# Altium project Bluetooh_Project.PrjPcb
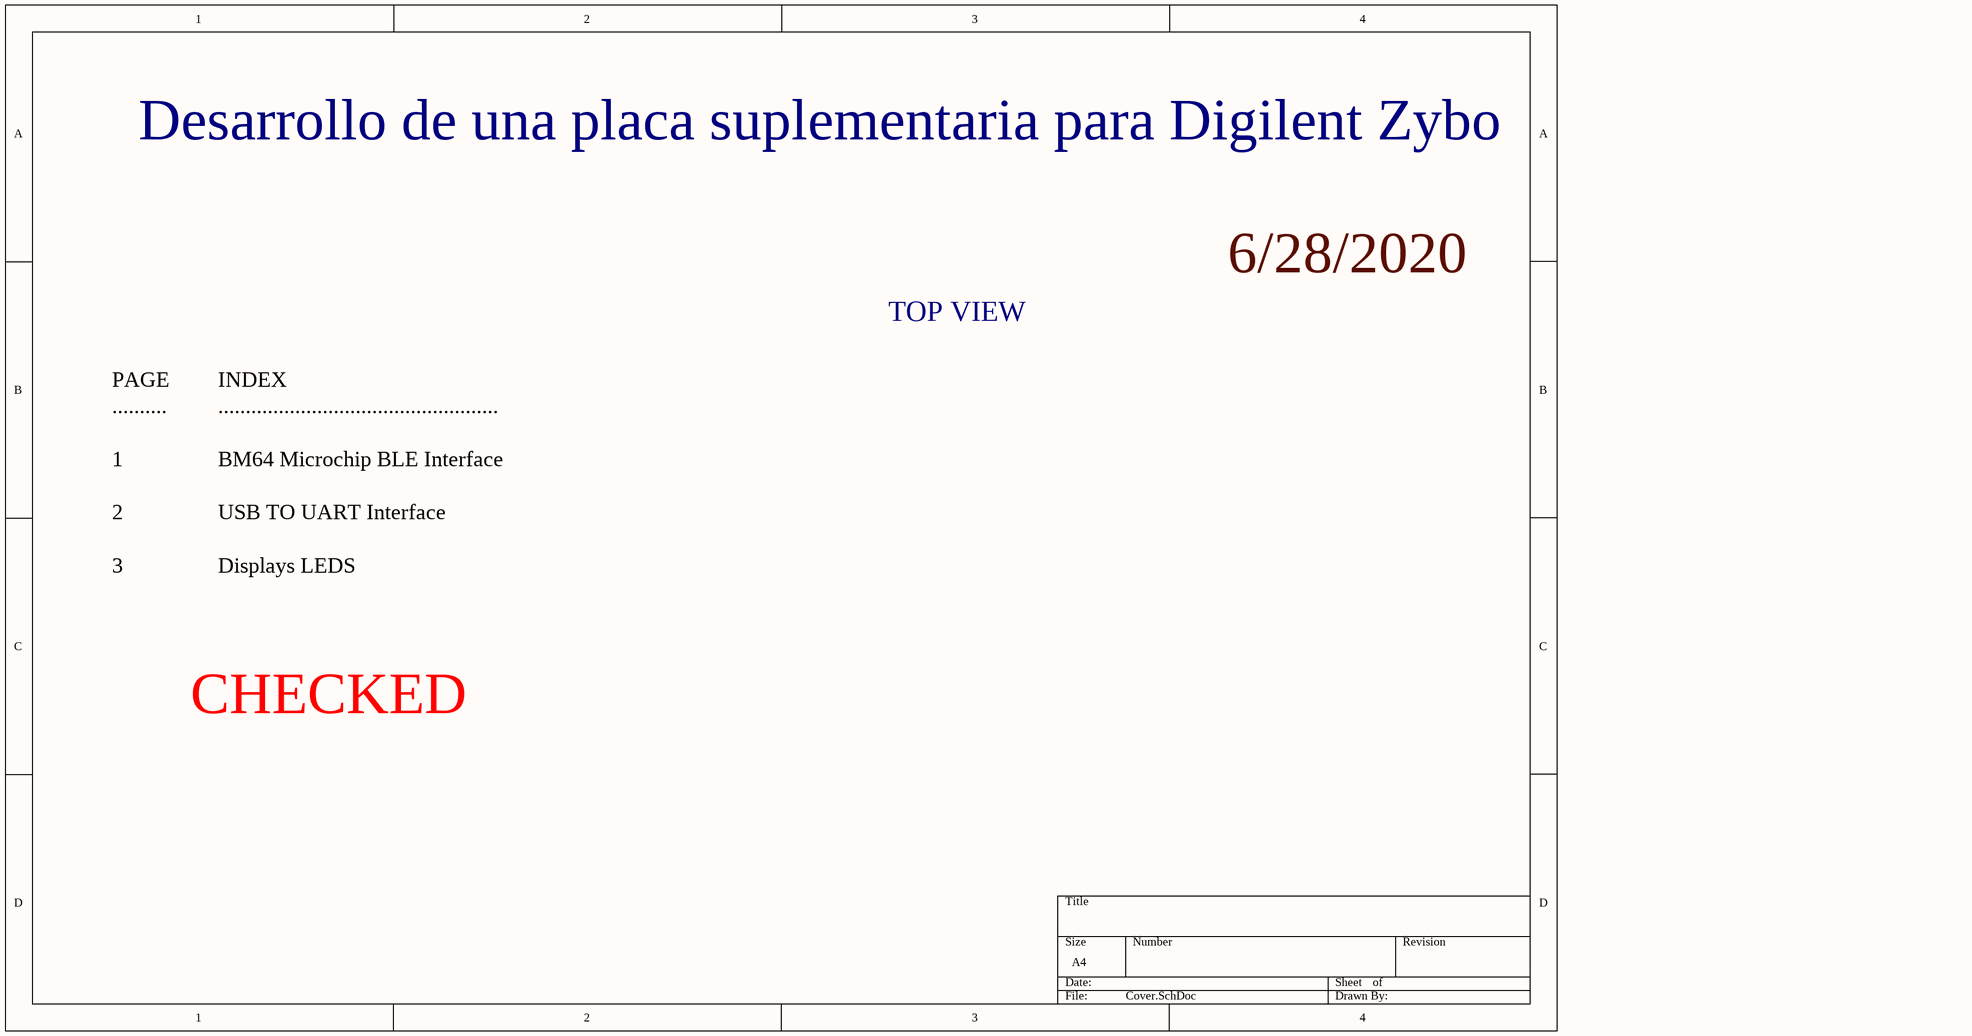
[diagram p0: Cover.SchDoc]
4 sheets, 59 parts. Net scope: global (net labels, ports and power ports of the same name join across sheets).
Board file: PCB1.PcbDoc
Sheets:
  Cover.SchDoc
  1_BLE.SchDoc
  2_USB_UART.SchDoc
  3_DISPLAY.SchDoc

## Sheet Cover.SchDoc
size A4; SheetNumber: 1; SheetTotal: 4

### Notes on the sheet
- Desarrollo de una placa suplementaria para Digilent Zybo
- 6/28/2020
- TOP VIEW
- PAGE
- ..........
- INDEX
- ...................................................
- 1
- BM64 Microchip BLE Interface
- 2
- 3
- USB TO UART Interface
- Displays LEDS
- CHECKED

## Sheet 1_BLE.SchDoc
size A4; SheetNumber: 2; SheetTotal: 4
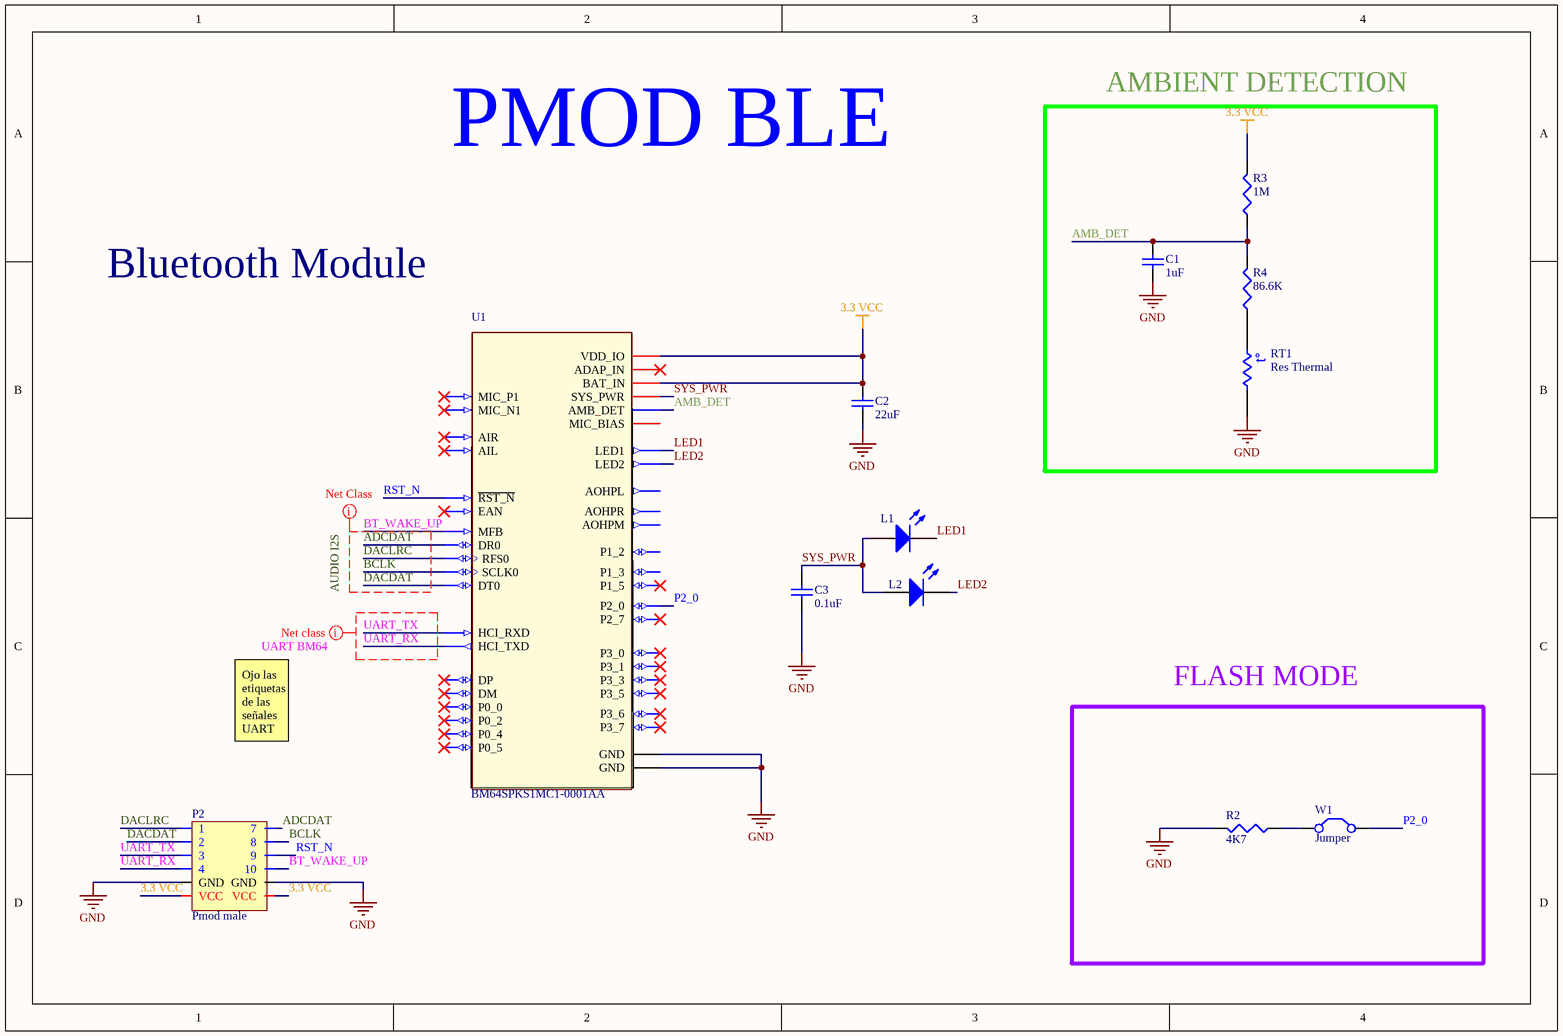
[diagram p1: 1_BLE.SchDoc]

### Parts
C1  1uF  [Cap0805]
C2  value 22uF  [C1210]  (hidden comment: Cap Semi)
C3  0.1uF  [Cap0805]
L1  LED1  [Diode1206]  (value not drawn)
L2  LED1  [Diode1206]  (value not drawn)
P2  Pmod male  [901220766]
R2  value 4K7  [Resistor 0805]  (hidden comment: Res3)
R3  value 1M  [Resistor 0805]  (hidden comment: Res3)
R4  value 86.6K  [Resistor 0805]  (hidden comment: Res3)
RT1  Res Thermal  [6-0805_N]
U1  BM64SPKS1MC1-0001AA  [*MODULE_BM64SPKS1MC1-0001AA]
W1  Jumper  [Shunt jumper]

### Blocks framed on the sheet
AMBIENT DETECTION: C1 R3 R4 RT1
FLASH MODE: R2 W1

### Nets
3.3 VCC: C2.2 P2.6(VCC) P2.12(VCC) R3.2 U1.21(VDD_IO) U1.22(BAT_IN)
GND: C1.1 C2.1 C3.2 P2.5(GND) P2.11(GND) R2.2 RT1.2 U1.14(GND) U1.43(GND)
ADCDAT: P2.7 U1.1(DR0)
AMB_DET: C1.2 R3.1 R4.2 U1.25(AMB_DET)
BCLK: P2.8 U1.3(SCLK0)
BT_WAKE_UP: P2.10 U1.26(MFB)
DACDAT: P2.2 U1.4(DT0)
DACLRC: P2.1 U1.2(RFS0)
LED1: L1.2(K) U1.28(LED1)
LED2: L2.2(K) U1.27(LED2)
P2_0: U1.41(P2_0) W1.2(C2)
RST_N: P2.9 U1.13(~{RST_N})
SYS_PWR: C3.1 L1.1(A) L2.1(A) U1.24(SYS_PWR)
UART_RX: P2.4 U1.20(HCI_TXD)
UART_TX: P2.3 U1.19(HCI_RXD)
NetR2_1: R2.1 W1.1(C1)
NetR4_1: R4.1 RT1.1

Not connected (* = marked no-connect by the designer): U1 5(AOHPR) 6(AOHPM) 7(AOHPL) 8(MIC_N1)* 9(MIC_P1)* 10(MIC_BIAS) 11(AIR)* 12(AIL)* 15(P1_2) 16(P1_3) 17(P0_4)* 18(P1_5)* 23(ADAP_IN)* 29(P3_7)* 30(P3_5)* 31(P0_0)* 32(EAN)* 33(DM)* 34(DP)* 35(P0_5)* 36(P3_0)* 37(P3_1)* 38(P3_3)* 39(P3_6)* 40(P0_2)* 42(P2_7)*

### Layout directives
net class AUDIO I2S: ADCDAT, BCLK, BT_WAKE_UP, DACDAT, DACLRC
net class UART BM64: UART_RX, UART_TX

### Notes on the sheet
- PMOD BLE
- Bluetooth Module
- Ojo las etiquetas de las señales UART son de las del dispositivo que se conecte
- (in symbol Res Thermal) t°

### Library data of the parts
C1 C3 = Cap: capacitor; ASiD Part Number: C-AS; Volte: 25v; ClassName: OutBuck
  C1: Value: 1uF
  C3: Value: 0.1uF
C2 = Cap Semi: Capacitor (Semiconductor SIM Model); Published: 8-Jun-2000; LatestRevisionDate: 29-May-2009; LatestRevisionNote: IPC-7351 Footprint Added.; PackageReference: C1206; Publisher: Altium Limited; PackageDescription: Chip Capacitor
L1 L2 = LED1: Typical RED GaAs LED; Published: 8-Jun-2000; LatestRevisionDate: 08-Jul-2005; LatestRevisionNote: Mech Layer 1 removed.; PackageReference: LED-1; Publisher: Altium Limited; PackageDescription: LED; 2 Leads; Digi-KeyReference: 732-13395-1-ND
P2 = Pmod male: p mod male 6 position 2 rows
R2-R4 = Res3: Resistor; Published: 8-Jun-2000; LatestRevisionDate: 29-May-2009; LatestRevisionNote: IPC-7351 Footprint Added.; PackageReference: J1-0603; Publisher: Altium Limited; PackageDescription: Chip Resistor
RT1 = Res Thermal: Thermistor; R at 25: 100k; Published: 24-Mar-1999; LatestRevisionDate: 29-May-2009; LatestRevisionNote: IPC-7351 Footprint Added.; PackageVersion: Mar-2003; PackageReference: 6-0805; Publisher: Altium Limited; PackageDescription: Chip Resistor 0805 Case Size; Code_IPC: RESC2012; Digi-KeyReference: BC2562CT-ND
U1 = BM64SPKS1MC1-0001AA: Bluetooth Bluetooth v5.0 Transceiver Module 2.4GHz Integrated, Trace Surface Mount; MF: Microchip; Availability: Unavailable; Package: Module Microchip; Price: None; MP: BM64SPKS1MC1-0001AA; SnapEDA_Link: https://www.snapeda.com/parts/BM64SPKS1MC1-0001AA/Microchip/view-part/613145/?ref=snap; Value: *
W1 = Jumper: Jumper Wire; Published: 24-Mar-1999; LatestRevisionDate: 17-Jul-2002; LatestRevisionNote: Re-released for DXP Platform.; PackageReference: RAD-0.2; Publisher: Altium Limited; PackageDescription: Radial Cap, Thru-Hole; 2 Leads; 0.2 in Pin Spacing; Digi-KeyReferencer: S9000-ND

## Sheet 2_USB_UART.SchDoc
size A4; SheetNumber: 3; SheetTotal: 4
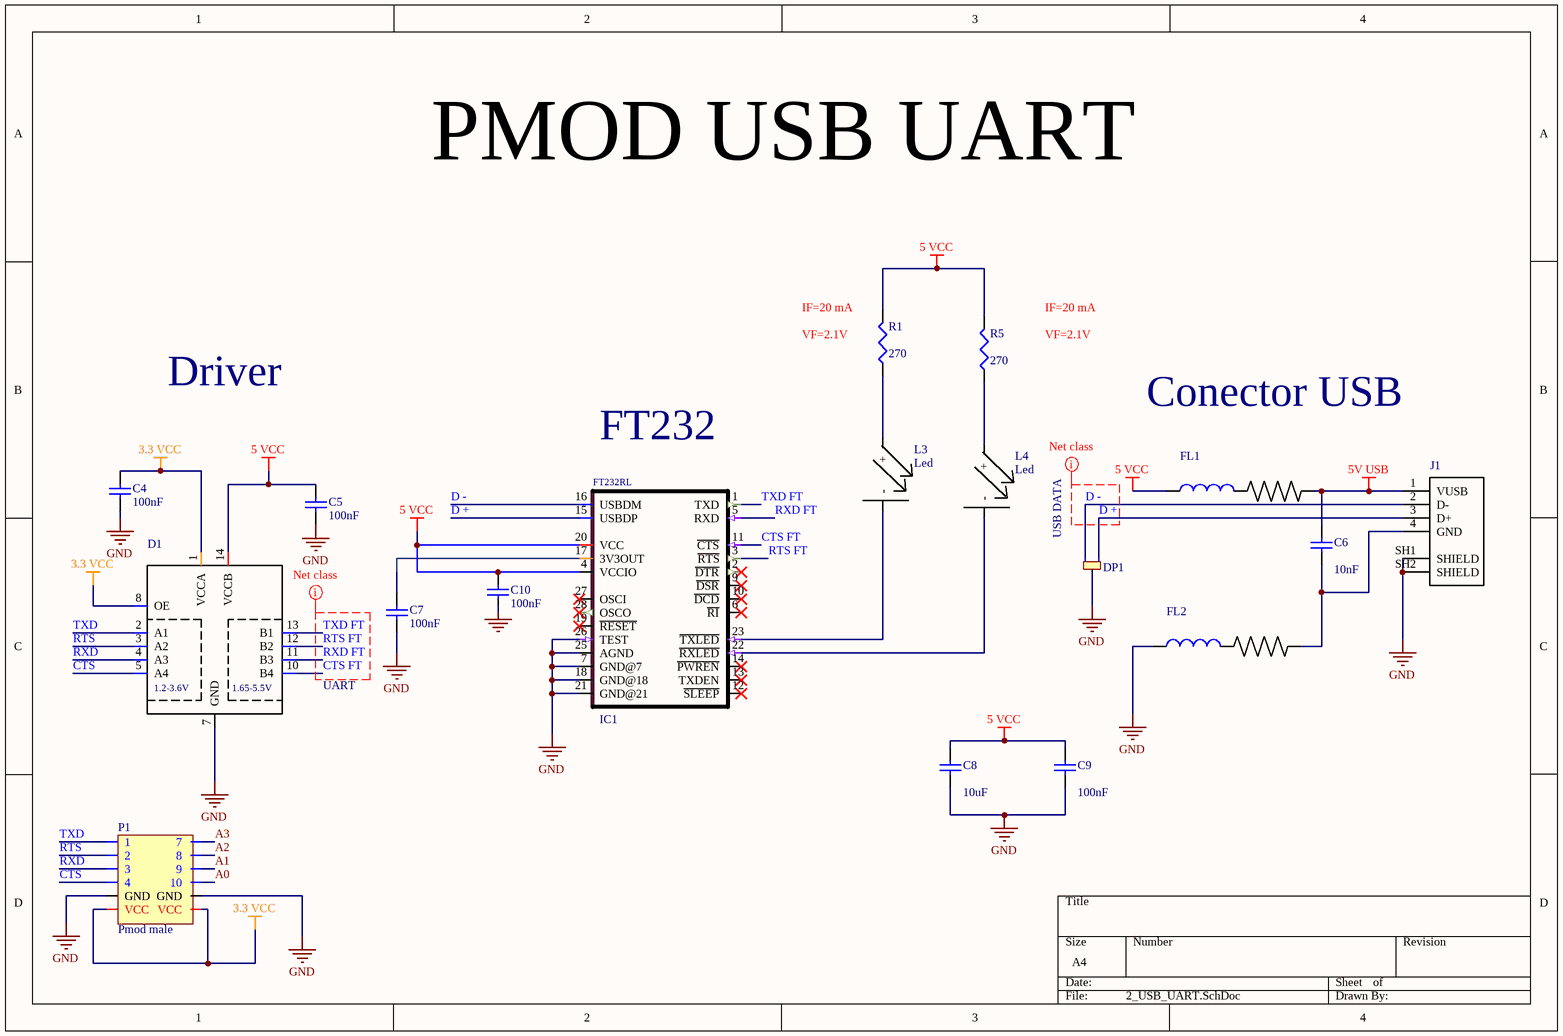
[diagram p2: 2_USB_UART.SchDoc]

### Parts
C4  value 100nF  [1608[0603]]  (hidden comment: Cap Semi)
C5  value 100nF  [1608[0603]]  (hidden comment: Cap Semi)
C6  value 10nF  [1608[0603]]  (hidden comment: Cap Semi)
C7  value 100nF  [1608[0603]]  (hidden comment: Cap Semi)
C8  value 10uF  [1608[0603]]  (hidden comment: Cap Semi)
C9  value 100nF  [1608[0603]]  (hidden comment: Cap Semi)
C10  value 100nF  [1608[0603]]  (hidden comment: Cap Semi)
D1  TXB0104PWR  [*TSSOP14]  (value not drawn)
DP1  PESD5V0U2BT,215  [*SOT95P230X110-3N]  (value not drawn)
FL1  BLM21PG221SN1D  [*BEADC2012X105N]  (value not drawn)
FL2  BLM21PG221SN1D  [*BEADC2012X105N]  (value not drawn)
IC1  FT232RL  [*SSOP28-LD]  (value not drawn)
J1  1-1734346-1  [*TE_1-1734346-1_1-1734346-1(Primary)]  (value not drawn)
L3  Led  [Diode1206 - PIN LETTER]
L4  Led  [Diode1206 - PIN LETTER]
P1  Pmod male  [901220766]
R1  value 270  [J1-0603]  (hidden comment: 270R)
R5  value 270  [J1-0603]  (hidden comment: 270R)

### Nets
3.3 VCC: C4.1 D1.1(VCCA) D1.8(OE) P1.6(VCC) P1.12(VCC)
5 VCC: C5.1 C8.2 C9.2 C10.1 D1.14(VCCB) FL1.1 IC1.4(VCCIO) IC1.20(VCC) R1.2 R5.2
5V USB: C6.2 FL1.2 J1.1(VUSB)
GND: C4.2 C5.2 C7.2 C8.1 C9.1 C10.2 D1.7(GND) DP1.3 FL2.1 IC1.7(GND@7) IC1.18(GND@18) IC1.21(GND@21) IC1.25(AGND) IC1.26(TEST) J1.SH1(SHIELD) J1.SH2(SHIELD) P1.5(GND) P1.11(GND)
A0: P1.10
A1: P1.9
A2: P1.8
A3: P1.7
CTS: D1.5(A4) P1.4
CTS FT: D1.10(B4) IC1.11(~{CTS})
D +: DP1.1 IC1.15(USBDP) J1.3(D+)
D -: DP1.2 IC1.16(USBDM) J1.2(D-)
RTS: D1.3(A2) P1.2
RTS FT: D1.12(B2) IC1.3(~{RTS})
RXD: D1.4(A3) P1.3
RXD FT: D1.11(B3) IC1.5(RXD)
TXD: D1.2(A1) P1.1
TXD FT: D1.13(B1) IC1.1(TXD)
NetC6_1: C6.1 FL2.2 J1.4(GND)
NetC7_1: C7.1 IC1.17(3V3OUT)
NetIC1_22: IC1.22(~{RXLED}) L4.K(-)
NetIC1_23: IC1.23(~{TXLED}) L3.K(-)
NetL3_A: L3.A(+) R1.1
NetL4_A: L4.A(+) R5.1

Not connected (* = marked no-connect by the designer): IC1 2(~{DTR})* 6(~{RI})* 9(~{DSR})* 10(~{DCD})* 12(~{SLEEP})* 13(TXDEN)* 14(~{PWREN})* 19(~{RESET})* 27(OSCI)* 28(OSCO)*

### Layout directives
net class USB DATA: D +, D -
net class UART: CTS FT, RTS FT, RXD FT, TXD FT

### Notes on the sheet
- PMOD USB UART
- (near R1) IF=20 mA
- IF=20 mA
- (near R1) VF=2.1V
- VF=2.1V
- Driver
- FT232
- Conector USB
- (in symbol TXB0104PWR) 1.2-3.6V; 1.65-5.5V

### Library data of the parts
C4-C10 = Cap Semi: Capacitor (Semiconductor SIM Model); Published: 8-Jun-2000; LatestRevisionDate: 29-May-2009; LatestRevisionNote: IPC-7351 Footprint Added.; PackageReference: C1206; Publisher: Altium Limited; PackageDescription: Chip Capacitor
D1 = TXB0104PWR: 4-Bit Bidirectional Voltage-Level Shifter with Auto Direction Sensing and +/-15 kV ESD Protect 14-TSSOP -40 to 85; MF: Texas Instruments; SnapEDA_Link: https://www.snapeda.com/parts/TXB0104PWR/Texas%20Instruments/view-part/?ref=snap; MP: TXB0104PWR; Availability: Unavailable; Price: None; Package: TSSOP-14 Texas Instruments; Value: *; Digi-KeyReference: 296-21929-1-ND
DP1 = PESD5V0U2BT,215: TVS DIODE 5V SOT23; Manufacturer 1: Nexperia; Supplier 1: Digi-Key; Manufacturer Part Number 1: PESD5V0U2BT,215; Stock 1: 61061; Pricing 1: 1=0,44000, 10=0,35300, 100=0,24020, 500=0,18012, 1000=0,13510 (USD); RoHS: No; ComponentLink1URL: https://assets.nexperia.com/documents/data-sheet/PESD5V0U2BT.pdf?src-supplier=Digi-Key; ComponentLink1Description: https://assets.nexperia.com/documents/data-sheet/PESD5V0U2BT.pdf?src-supplier=Digi-Key; Supplier Part Number 1: 1727-3936-1-ND; Digi-KeyReference: 1727-3936-1-ND
FL1 FL2 = BLM21PG221SN1D: 220 Ohms @ 100MHz 1 Power Line Ferrite Bead 0805 (2012 Metric) 2A 45mOhm; MF: Murata; Package: 2012 Murata; Digi-Key_Part_Number: 490-1054-1-ND; SnapEDA_Link: https://www.snapeda.com/parts/BLM21PG221SN1D/Murata/view-part/12270/?ref=snap; MP: BLM21PG221SN1D; Value: *
IC1 = FT232RL: USB-to-UART 1-CH 256Byte FIFO 5V 28-Pin SSOP; MF: FTDI, Future; Availability: Unavailable; Package: SSOP-28 FTDI, Future; SnapEDA_Link: https://www.snapeda.com/parts/FT232RL/FTDI%2C%20Future%20Technology%20Devices%20International%20Ltd/view-part/?ref=snap; Price: None; MP: FT232RL; Value: *; Digi-KeyReference: 768-1007-1-ND
J1 = 1-1734346-1: Conn USB 2.0 Type B RCP 4 POS 1.25mm Solder RA SMD 4 Terminal 1 Port T/R; MF: TE Connectivity; MP: 1-1734346-1; SnapEDA_Link: https://www.snapeda.com/parts/1-1734346-1/TE%20Connectivity%20AMP%20Connectors/view-part/512451/?ref=snap; EU_RoHS_Compliance: Compliant; Digi-Key_Part_Number: A110862CT-ND; DigiKey-Purchase-URL: https://snapeda.com/shop?store=DigiKey&id=512451; Package: None; Value: *
P1 = Pmod male: p mod male 6 position 2 rows
R1 R5 = Res3: Resistor; Published: 8-Jun-2000; LatestRevisionDate: 29-May-2009; LatestRevisionNote: IPC-7351 Footprint Added.; PackageReference: J1-0603; Publisher: Altium Limited; PackageDescription: Chip Resistor
L3 L4 = Led: Digi-KeyReference: 732-13395-1-ND

## Sheet 3_DISPLAY.SchDoc
size A4; SheetNumber: 4; SheetTotal: 4
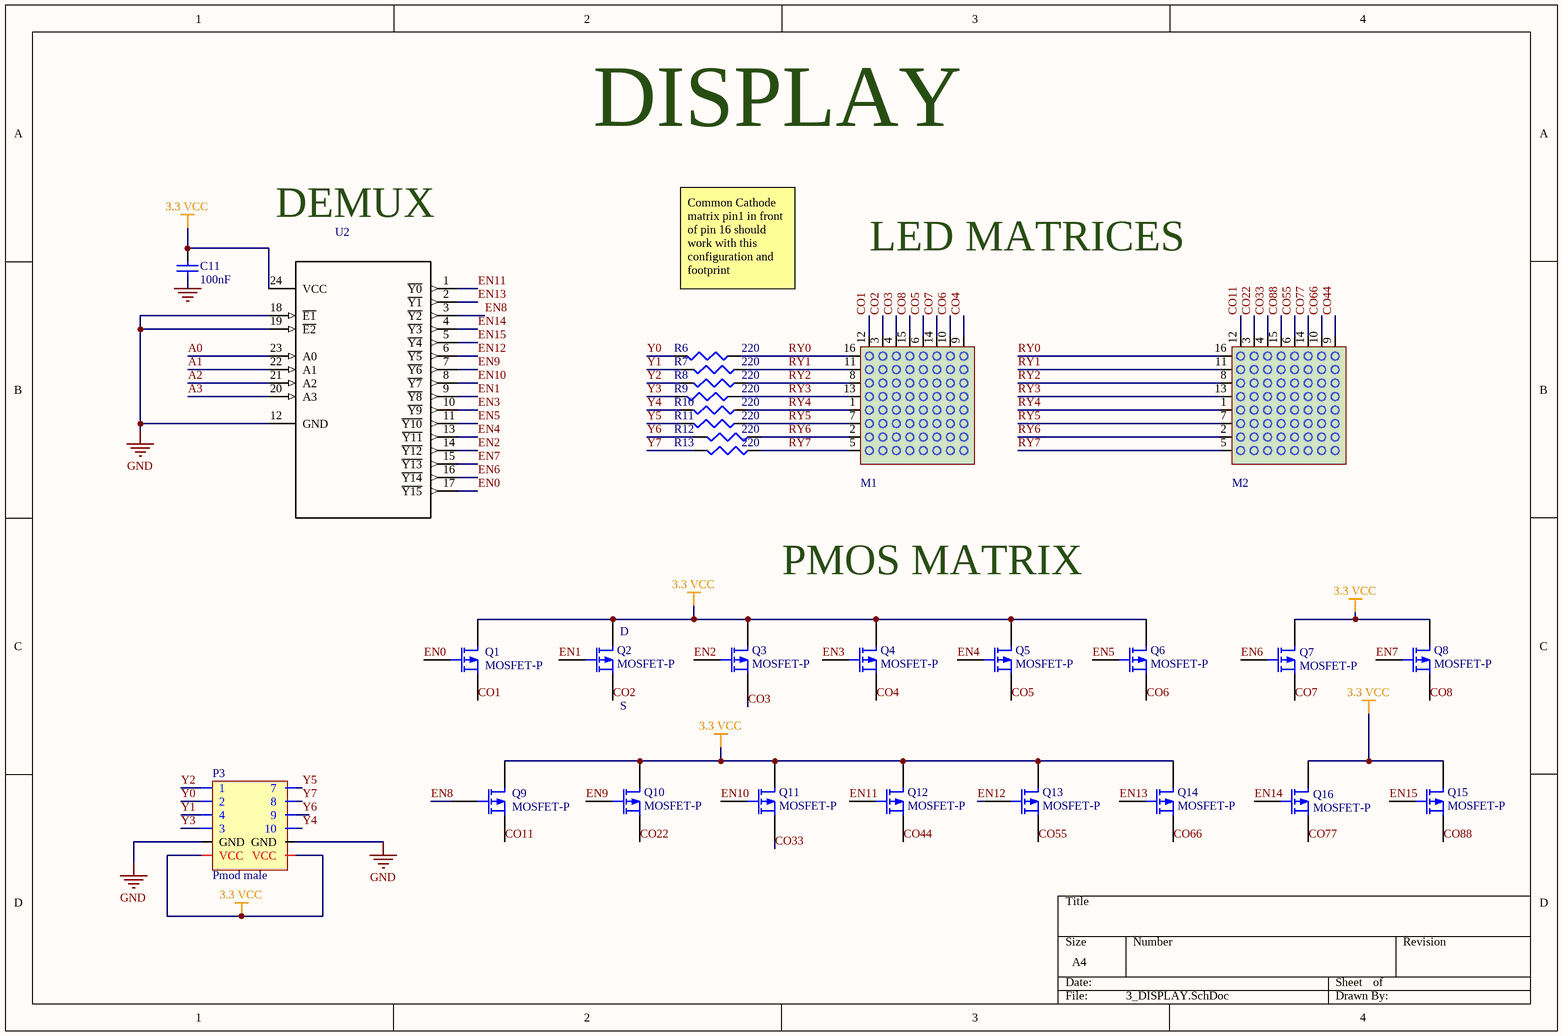
[diagram p3: 3_DISPLAY.SchDoc]

### Parts
C11  value 100nF  [1608[0603]]  (hidden comment: Cap Semi)
M1  matrix8X8  [Matrix Led]  (value not drawn)
M2  matrix8X8  [Matrix Led]  (value not drawn)
P3  Pmod male  [901220766]
Q1  MOSFET-P  [BSS84PWH6327XTSA1]
Q2  MOSFET-P  [BSS84PWH6327XTSA1]
Q3  MOSFET-P  [BSS84PWH6327XTSA1]
Q4  MOSFET-P  [BSS84PWH6327XTSA1]
Q5  MOSFET-P  [BSS84PWH6327XTSA1]
Q6  MOSFET-P  [BSS84PWH6327XTSA1]
Q7  MOSFET-P  [BSS84PWH6327XTSA1]
Q8  MOSFET-P  [BSS84PWH6327XTSA1]
Q9  MOSFET-P  [BSS84PWH6327XTSA1]
Q10  MOSFET-P  [BSS84PWH6327XTSA1]
Q11  MOSFET-P  [BSS84PWH6327XTSA1]
Q12  MOSFET-P  [BSS84PWH6327XTSA1]
Q13  MOSFET-P  [BSS84PWH6327XTSA1]
Q14  MOSFET-P  [BSS84PWH6327XTSA1]
Q15  MOSFET-P  [BSS84PWH6327XTSA1]
Q16  MOSFET-P  [BSS84PWH6327XTSA1]
R6  value 220  [Resistor 0805]  (hidden comment: 270R)
R7  value 220  [Resistor 0805]  (hidden comment: 270R)
R8  value 220  [Resistor 0805]  (hidden comment: 270R)
R9  value 220  [Resistor 0805]  (hidden comment: 270R)
R10  value 220  [Resistor 0805]  (hidden comment: 270R)
R11  value 220  [Resistor 0805]  (hidden comment: 270R)
R12  value 220  [Resistor 0805]  (hidden comment: 270R)
R13  value 220  [Resistor 0805]  (hidden comment: 270R)
U2  CD74HC154M  [*SOIC127P1030X265-24N]  (value not drawn)

### Nets
3.3 VCC: C11.1 P3.6(VCC) P3.12(VCC) Q1.3(D) Q2.3(D) Q3.3(D) Q4.3(D) Q5.3(D) Q6.3(D) Q7.3(D) Q8.3(D) Q9.3(D) Q10.3(D) Q11.3(D) Q12.3(D) Q13.3(D) Q14.3(D) Q15.3(D) Q16.3(D) U2.24(VCC)
GND: C11.2 P3.5(GND) P3.11(GND) U2.12(GND) U2.18(~{E1}) U2.19(~{E2})
A0: U2.23(A0)
A1: U2.22(A1)
A2: U2.21(A2)
A3: U2.20(A3)
CO1: M1.12 Q1.2(S)
CO2: M1.3 Q2.2(S)
CO3: M1.4 Q3.2(S)
CO4: M1.9 Q4.2(S)
CO5: M1.6 Q5.2(S)
CO6: M1.10 Q6.2(S)
CO7: M1.14 Q7.2(S)
CO8: M1.15 Q8.2(S)
CO11: M2.12 Q9.2(S)
CO22: M2.3 Q10.2(S)
CO33: M2.4 Q11.2(S)
CO44: M2.9 Q12.2(S)
CO55: M2.6 Q13.2(S)
CO66: M2.10 Q14.2(S)
CO77: M2.14 Q16.2(S)
CO88: M2.15 Q15.2(S)
EN0: Q1.1(G) U2.17(~{Y15})
EN1: Q2.1(G) U2.9(~{Y8})
EN2: Q3.1(G) U2.14(~{Y12})
EN3: Q4.1(G) U2.10(~{Y9})
EN4: Q5.1(G) U2.13(~{Y11})
EN5: Q6.1(G) U2.11(~{Y10})
EN6: Q7.1(G) U2.16(~{Y14})
EN7: Q8.1(G) U2.15(~{Y13})
EN8: Q9.1(G) U2.3(~{Y2})
EN9: Q10.1(G) U2.7(~{Y6})
EN10: Q11.1(G) U2.8(~{Y7})
EN11: Q12.1(G) U2.1(~{Y0})
EN12: Q13.1(G) U2.6(~{Y5})
EN13: Q14.1(G) U2.2(~{Y1})
EN14: Q16.1(G) U2.4(~{Y3})
EN15: Q15.1(G) U2.5(~{Y4})
RY0: M1.16 M2.16 R6.1
RY1: M1.11 M2.11 R7.1
RY2: M1.8 M2.8 R8.1
RY3: M1.13 M2.13 R9.1
RY4: M1.1 M2.1 R10.1
RY5: M1.7 M2.7 R11.1
RY6: M1.2 M2.2 R12.1
RY7: M1.5 M2.5 R13.1
Y0: P3.2 R6.2
Y1: P3.4 R7.2
Y2: P3.1 R8.2
Y3: P3.3 R9.2
Y4: P3.10 R10.2
Y5: P3.7 R11.2
Y6: P3.9 R12.2
Y7: P3.8 R13.2

### Notes on the sheet
- DISPLAY
- DEMUX
- Common Cathode matrix pin1 in front of pin 16 should work with this configuration and footprint
- LED MATRICES
- PMOS MATRIX
- (near Q2) D
- (near Q2) S

### Library data of the parts
C11 = Cap Semi: Capacitor (Semiconductor SIM Model); Published: 8-Jun-2000; LatestRevisionDate: 29-May-2009; LatestRevisionNote: IPC-7351 Footprint Added.; PackageReference: C1206; Publisher: Altium Limited; PackageDescription: Chip Capacitor
P3 = Pmod male: p mod male 6 position 2 rows
Q1-Q16 = MOSFET-P: P-Channel MOSFET; Published: 8-Jun-2000; LatestRevisionDate: 17-Jul-2002; LatestRevisionNote: Re-released for DXP Platform.; PackageVersion: 1995/1996; PackageReference: E3; Publisher: Altium Limited; PackageDescription: TO, Flat Index; 3 In-Line, Axial Leads; Body Dia. 4.6mm; Lead Dia. 0.5 mm (max); Digi-KeyReference: BSS84PWH6327XTSA1CT-ND
R6-R13 = Res3: Resistor; Published: 8-Jun-2000; LatestRevisionDate: 29-May-2009; LatestRevisionNote: IPC-7351 Footprint Added.; PackageReference: J1-0603; Publisher: Altium Limited; PackageDescription: Chip Resistor
U2 = CD74HC154M: Decoder/Demultiplexer 1 x 4:16 24-SOIC; MF: Texas Instruments; MP: CD74HC154M; SnapEDA_Link: https://www.snapeda.com/parts/CD74HC154M/Texas%20Instruments/view-part/231174/?ref=snap; Availability: Unavailable; Package: SOIC-24 Texas Instruments; Price: None; Value: *; Digi-KeyReference: 296-24352-2-ND

## Nets that join several sheets
3.3 VCC: 1_BLE (6 pins), 2_USB_UART (5 pins), 3_DISPLAY (20 pins)
GND: 1_BLE (9 pins), 2_USB_UART (18 pins), 3_DISPLAY (6 pins)
A0: 2_USB_UART (P1.10), 3_DISPLAY (U2.23)
A1: 2_USB_UART (P1.9), 3_DISPLAY (U2.22)
A2: 2_USB_UART (P1.8), 3_DISPLAY (U2.21)
A3: 2_USB_UART (P1.7), 3_DISPLAY (U2.20)